# EAGLE design UART com Bluetooth (EAGLE 9.1.2)
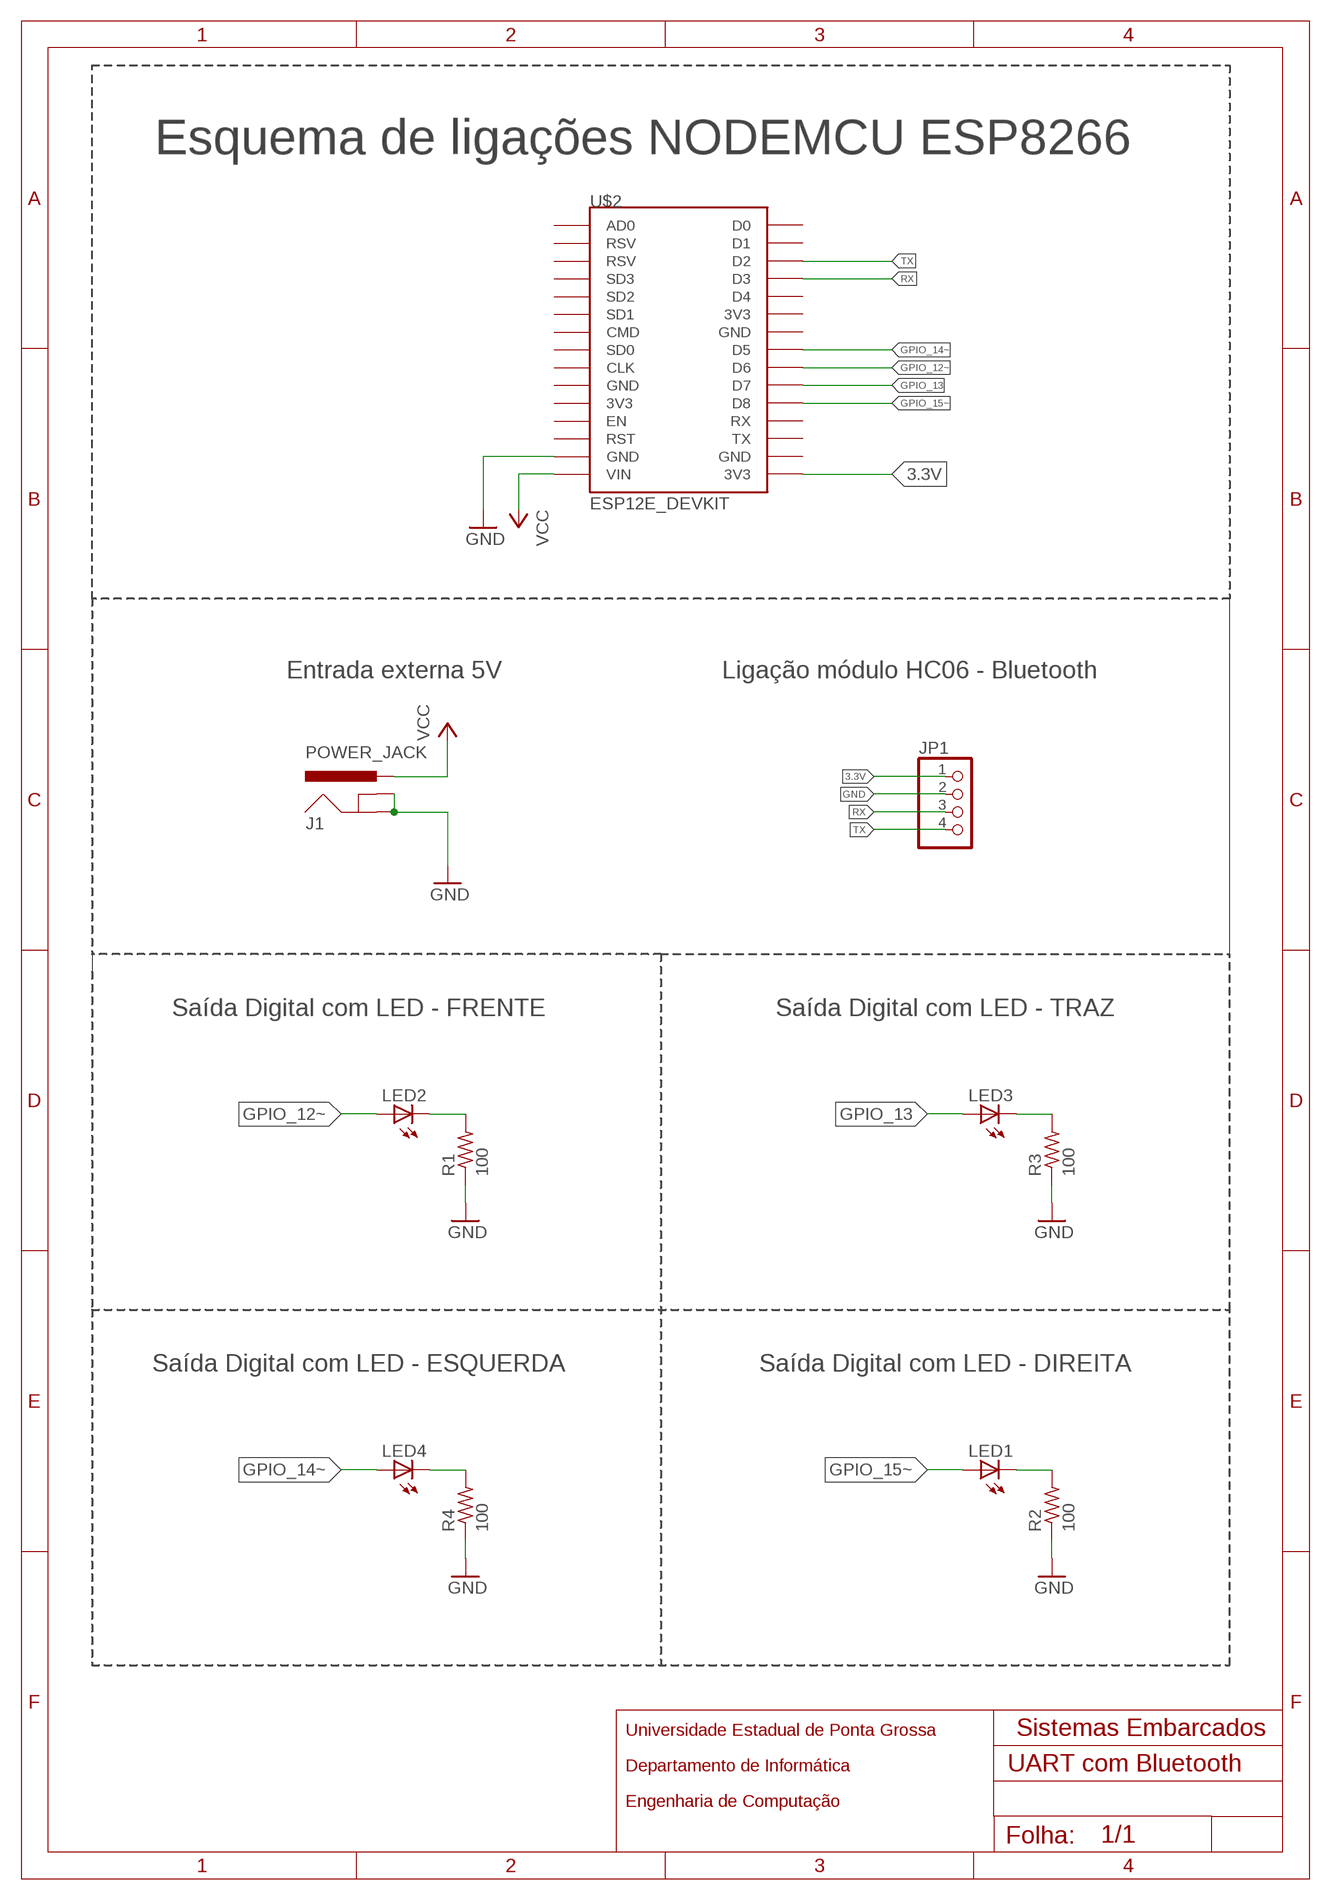
[diagram p0: schematic, sheet 1]

## Parts
J1  POWER_JACK  [POWER_JACK_PTH]
JP1  PINHD-1X4  [1X04]
LED1  LED5MM  [LED5MM]
LED2  LED5MM  [LED5MM]
LED3  LED5MM  [LED5MM]
LED4  LED5MM  [LED5MM]
R1  100  R-US_0204/7  [0204/7]
R2  100  R-US_0204/7  [0204/7]
R3  100  R-US_0204/7  [0204/7]
R4  100  R-US_0204/7  [0204/7]
U$2  ESP12E_DEVKIT  [ESP12E_DEVKIT]

## Nets
3.3V: JP1.1 U$2.3V3@2(3V3)
GND: J1.GND J1.GNDBREAK JP1.2 R1.1 R2.1 R3.1 R4.1 U$2.GND@1(GND)
GPIO_12~: LED2.A U$2.D6
GPIO_13: LED3.A U$2.D7
GPIO_14~: LED4.A U$2.D5
GPIO_15~: LED1.A U$2.D8
N$1: LED2.K(C) R1.2
N$2: LED3.K(C) R3.2
N$3: LED4.K(C) R4.2
N$4: LED1.K(C) R2.2
RX: JP1.3 U$2.D3
TX: JP1.4 U$2.D2
VCC: J1.PWR U$2.VIN
Unconnected: U$2.3V3@0(3V3) U$2.3V3@1(3V3) U$2.AD0 U$2.CLK U$2.CMD U$2.D0 U$2.D1 U$2.D4 U$2.EN U$2.GND@0(GND) U$2.GND@2(GND) U$2.GND@3(GND) U$2.RST U$2.RSV@0(RSV) U$2.RSV@1(RSV) U$2.RX U$2.SD0 U$2.SD1 U$2.SD2 U$2.SD3 U$2.TX

## Notes on the sheet
- Esquema de ligações NODEMCU ESP8266
- Entrada externa 5V | Ligação módulo HC06 - Bluetooth
- Saída Digital com LED - FRENTE | Saída Digital com LED - TRAZ
- Saída Digital com LED - ESQUERDA | Saída Digital com LED - DIREITA

## Library data of the parts
J1 = SparkFun-Connectors:POWER_JACK: Power Jack Connector This is the standard 5.5mm barrel jack for power. The PTH is the most common, proven, reliable, footprint. The Slot footprint only works if the mill layer is transmitted to the PCB fab house so be warned. Here are the connectors we sell at SparkFun: DC Barrel Power Jack/Connector <https://www.sparkfun.com/products/119> (PRT-00119) DC Barrel Power Jack/Connector (SMD) <https://www.sparkfun.com/products/12748> (PRT-12748) DC Barrel Jack Adapter - Breadboard Compatible <https://www.sparkfun.com/products/10811> (PRT-10811) It is used on this SparkFun product (and many, many others): SparkFun RedBoard - Programmed with Arduino <https://www.sparkfun.com/products/12757> (DEV-12757) Also, if you need a mating power supply or connector, please check these out: Wall Adapter Power Supply - 9VDC 650mA <https://www.sparkfun.com/products/298> (TOL-00298) DC Barrel Jack Adapter - Male <https://www.sparkfun.com/products/10287> (PRT-10287); PROD_ID: CONN-08197
JP1 = pinhead:PINHD-1X4: PIN HEADER
LED1-LED4 = led:LED: LED OSRAM: - CHIPLED LG R971, LG N971, LY N971, LG Q971, LY Q971, LO R971, LY R971 LH N974, LH R974 LS Q976, LO Q976, LY Q976 LO Q996 - Hyper CHIPLED LW Q18S LB Q993, LB Q99A, LB R99A - SideLED LS A670, LO A670, LY A670, LG A670, LP A670 LB A673, LV A673, LT A673, LW A673 LH A674 LY A675 LS A676, LA A676, LO A676, LY A676, LW A676 LS A679, LY A679, LG A679 - Hyper Micro SIDELED® LS Y876, LA Y876, LO Y876, LY Y876 LT Y87S - SmartLED LW L88C, LW L88S LB L89C, LB L89S, LG L890 LS L89K, LO L89K, LY L89K LS L896, LA L896, LO L896, LY L896 - TOPLED LS T670, LO T670, LY T670, LG T670, LP T670 LSG T670, LSP T670, LSY T670, LOP T670, LYG T670 LG T671, LOG T671, LSG T671 LB T673, LV T673, LT T673, LW T673 LH T674 LS T676, LA T676, LO T676, LY T676, LB T676, LH T676, LSB T676, LW T676 LB T67C, LV T67C, LT T67C, LS T67K, LO T67K, LY T67K, LW E67C LS E67B, LA E67B, LO E67B, LY E67B, LB E67C, LV E67C, LT E67C LW T67C LS T679, LY T679, LG T679 LS T770, LO T770, LY T770, LG T770, LP T770 LB T773, LV T773, LT T773, LW T773 LH T774 LS E675, LA E675, LY E675, LS T675 LS T776, LA T776, LO T776, LY T776, LB T776 LHGB T686 LT T68C, LB T68C - Hyper Mini TOPLED® LB M676 - Mini TOPLED Santana® LG M470 LS M47K, LO M47K, LY M47K Source: http://www.osram.convergy.de LUXEON: - LUMILED® LXK2-PW12-R00, LXK2-PW12-S00, LXK2-PW14-U00, LXK2-PW14-V00 LXK2-PM12-R00, LXK2-PM12-S00, LXK2-PM14-U00 LXK2-PE12-Q00, LXK2-PE12-R00, LXK2-PE12-S00, LXK2-PE14-T00, LXK2-PE14-U00 LXK2-PB12-K00, LXK2-PB12-L00, LXK2-PB12-M00, LXK2-PB14-N00, LXK2-PB14-P00, LXK2-PB14-Q00 LXK2-PR12-L00, LXK2-PR12-M00, LXK2-PR14-Q00, LXK2-PR14-R00 LXK2-PD12-Q00, LXK2-PD12-R00, LXK2-PD12-S00 LXK2-PH12-R00, LXK2-PH12-S00 LXK2-PL12-P00, LXK2-PL12-Q00, LXK2-PL12-R00 Source: www.luxeon.com KINGBRIGHT: KA-3528ASYC Source: www.kingbright.com
R1-R4 = rcl:R-US_: RESISTOR, American symbol; SPICEPREFIX: R
U$2 = ESP12E_DEVKIT:ESP12E_DEVKIT: ESP12E DEVKIT BOARD

## Net classes
0 default: width 0.762 mm

## Board
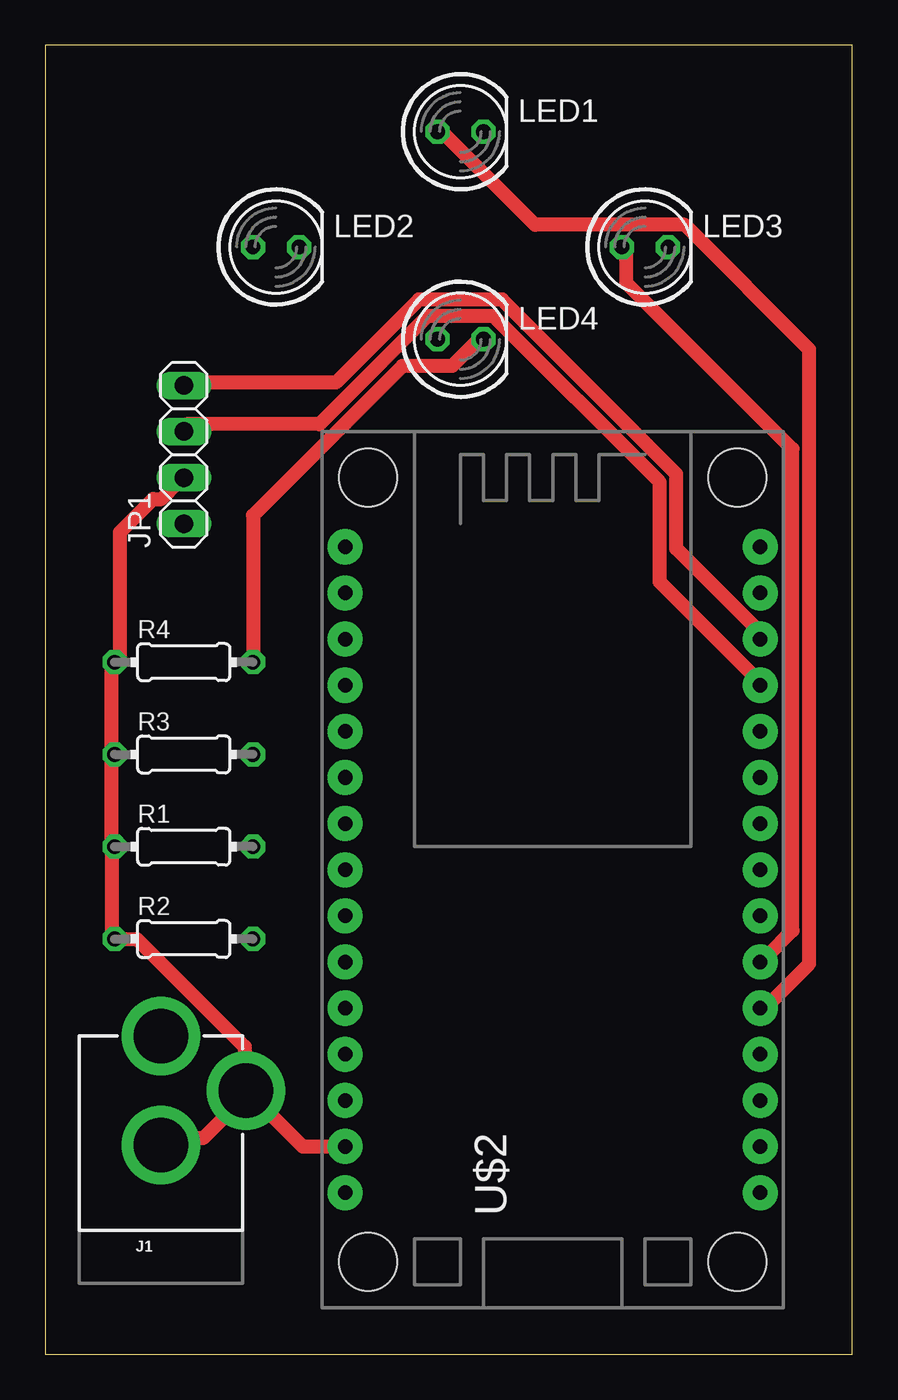
[diagram p1: board, top side]
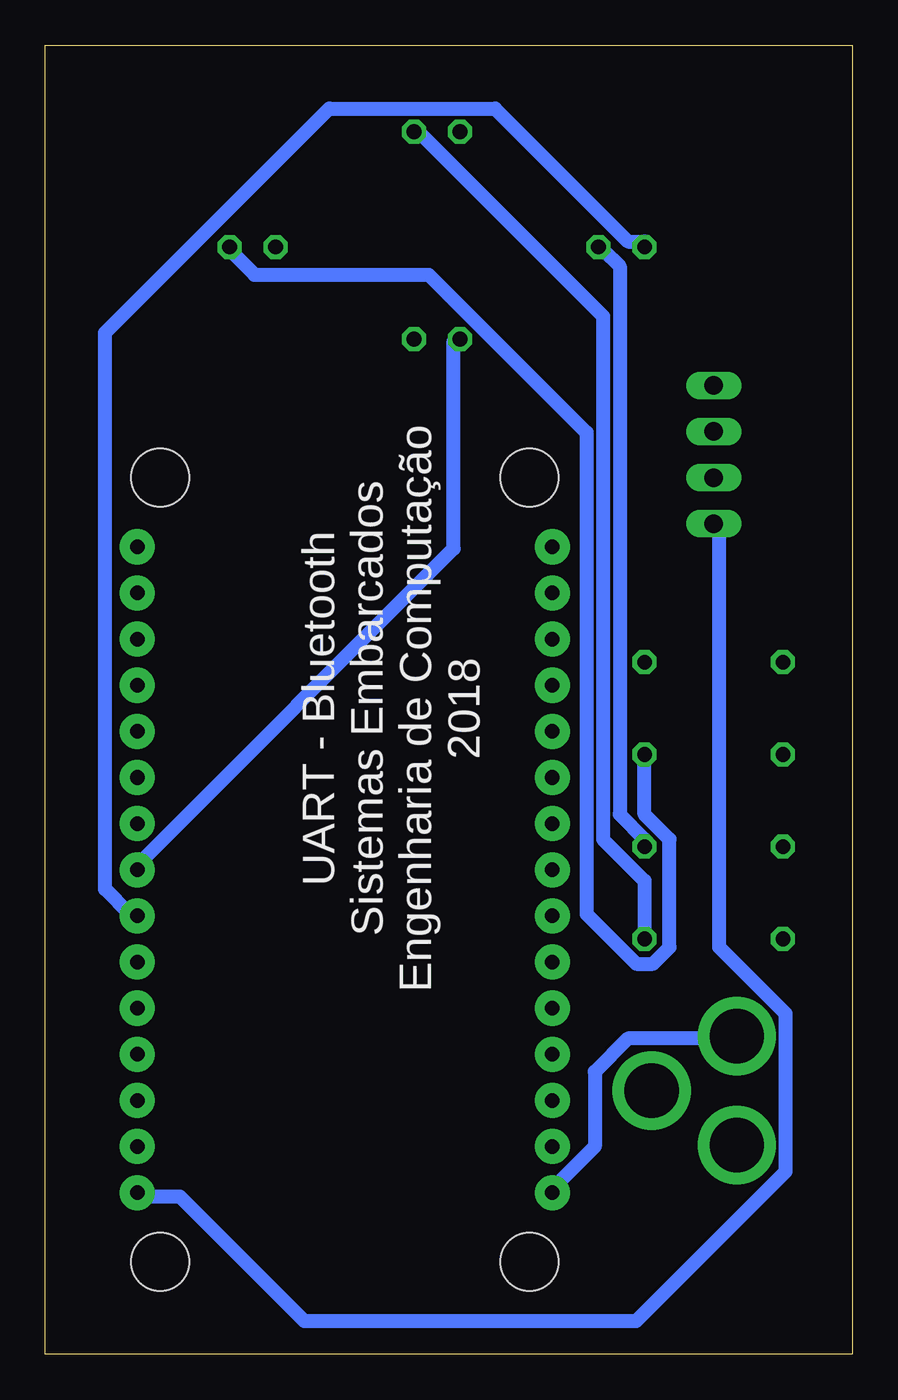
[diagram p2: board, bottom side, seen from below]

Size 44.43 x 72.06 mm. Coordinates in mm from the lower left corner, seen from the top.
Outline: 0,0 44.43,0 44.43,72.06 0,72.06 0,0
Copper layers (1*16): Top 0.035mm / dielectric 1.5mm / Bottom 0.035mm
Design rules "default": minimum track width 6mil, minimum drill 0.35mm, track to track 6mil, track to pad 6mil, pad to pad 6mil, via to via 6mil, smd to smd 6mil, copper to edge 40mil, drill to drill 6mil, minimum pad ring 10mil, minimum via ring 8mil, stop-mask expansion 4mil, vias tented up to drill 0mil, thermal gap 10mil

### Footprints (pad centres in the part's own frame; a part is rotated, then mirrored left to right if it is on the bottom)
POWER_JACK_PTH = drill 2.997 pad 4.318: GND 0,7.7; GNDBREAK 4.7,10.7; PWR 0,13.7
1X04 = drill 1.016 long: 1 -3.81,0; 2 -1.27,0; 3 1.27,0; 4 3.81,0
LED5MM = drill 0.813 octagon: A -1.27,0; K 1.27,0
0204/7 = drill 0.813 octagon: 1 -3.81,0; 2 3.81,0
ESP12E_DEVKIT = drill 0.8 pad 1.93: 3V3@0 -11.43,-7.62; 3V3@1 11.43,5.08; 3V3@2 11.43,-17.78; AD0 -11.43,17.78; CLK -11.43,-2.54; CMD -11.43,2.54; D0 11.43,17.78; D1 11.43,15.24; D2 11.43,12.7; D3 11.43,10.16; D4 11.43,7.62; D5 11.43,0; D6 11.43,-2.54; D7 11.43,-5.08; D8 11.43,-7.62; EN -11.43,-10.16; GND@0 -11.43,-5.08; GND@1 -11.43,-15.24; GND@2 11.43,2.54; GND@3 11.43,-15.24; RST -11.43,-12.7; RSV@0 -11.43,15.24; RSV@1 -11.43,12.7; RX 11.43,-10.16; SD0 -11.43,0; SD1 -11.43,5.08; SD2 -11.43,7.62; SD3 -11.43,10.16; TX 11.43,-12.7; VIN -11.43,-17.78 | hole 3.2: -10.16,21.59; 10.16,21.59; 10.16,-21.59; -10.16,-21.59

### Placement (x,y rotation side)
J1  6.35,3.81 0 top
JP1  7.62,49.53 90 top
LED1  22.86,67.31 0 top
LED2  12.7,60.96 0 top
LED3  33.02,60.96 0 top
LED4  22.86,55.88 0 top
R1  7.62,27.94 0 top
R2  7.62,22.86 0 top
R3  7.62,33.02 0 top
R4  7.62,38.1 0 top
U$2  27.94,26.67 0 top

### Tracks (layer width: path | path; a pad name or v marks a point on that pad's centre or on a via)
3.3V
  Bottom 0.762: JP1.1 7.32,45.72 7.32,22.4 3.66,18.75 3.66,10.06 11.89,1.83 30.18,1.83 37.03,8.69 39.32,8.69 U$2.3V3@2
GND
  Top 0.762: U$2.GND@1 16.46,11.43 14.17,11.43 11.43,14.17 J1.GNDBREAK | J1.GND 6.4,11.89 8.69,11.89 10.97,14.17 J1.GNDBREAK | JP1.2 7.32,48.01 6.4,47.09 5.94,47.09 4.12,45.26 4.12,38.41 R4.1 3.66,37.95 3.66,33.38 R3.1 3.66,32.92 3.66,28.35 R1.1 3.66,27.89 3.66,22.86 R2.1 4.12,22.86 5.03,22.86 10.97,16.92 10.97,14.63 J1.GNDBREAK
GPIO_12~
  Bottom 0.762: LED2.A 11.43,61.27 12.34,61.27 19.66,68.58 28.8,68.58 41.15,56.24 41.15,25.6 39.78,24.23 U$2.D6
GPIO_13
  Top 0.762: LED3.A 32,60.81 32,58.98 41.15,49.84 41.15,23.32 39.78,21.95 U$2.D7
GPIO_14~
  Bottom 0.762: LED4.A 21.95,55.78 21.95,44.35 39.32,26.98 U$2.D5
GPIO_15~
  Top 0.762: LED1.A 21.95,67.21 26.98,62.18 35.2,62.18 42.06,55.32 42.06,21.49 39.78,19.2 U$2.D8
N$1
  Bottom 0.762: R1.2 11.43,28.35 12.8,29.72 12.8,59.89 13.72,60.81 LED2.K
N$2
  Bottom 0.762: R3.2 11.43,32.92 11.43,29.72 10.06,28.35 10.06,22.4 10.97,21.49 11.89,21.49 14.63,24.23 14.63,50.75 23.32,59.44 32.92,59.44 34.29,60.81 LED3.K
N$3
  Top 0.762: R4.2 11.43,38.41 11.43,46.18 19.66,54.41 22.4,54.41 23.77,55.78 LED4.K
N$4
  Bottom 0.762: R2.2 11.43,26.06 13.72,28.35 13.72,57.15 23.77,67.21 LED1.K
RX
  Top 0.762: JP1.3 7.77,51.21 15.09,51.21 21.03,57.15 24.69,57.15 33.83,48.01 33.83,42.52 39.32,37.03 U$2.D3
TX
  Top 0.762: JP1.4 7.77,53.49 16,53.49 20.57,58.06 25.15,58.06 34.75,48.46 34.75,44.35 39.32,39.78 U$2.D2
VCC
  Bottom 0.762: U$2.VIN 16.46,9.14 14.17,11.43 14.17,15.54 12.34,17.37 6.4,17.37 J1.PWR

### Text on the board
bPlace: UART - Bluetooth / Sistemas Embarcados / Engenharia de Computação / 2018